# EAGLE schematic TommyPROM-uno (EAGLE 8.0.0)
Tom's EPROM programmer hosted on Arduino Uno.
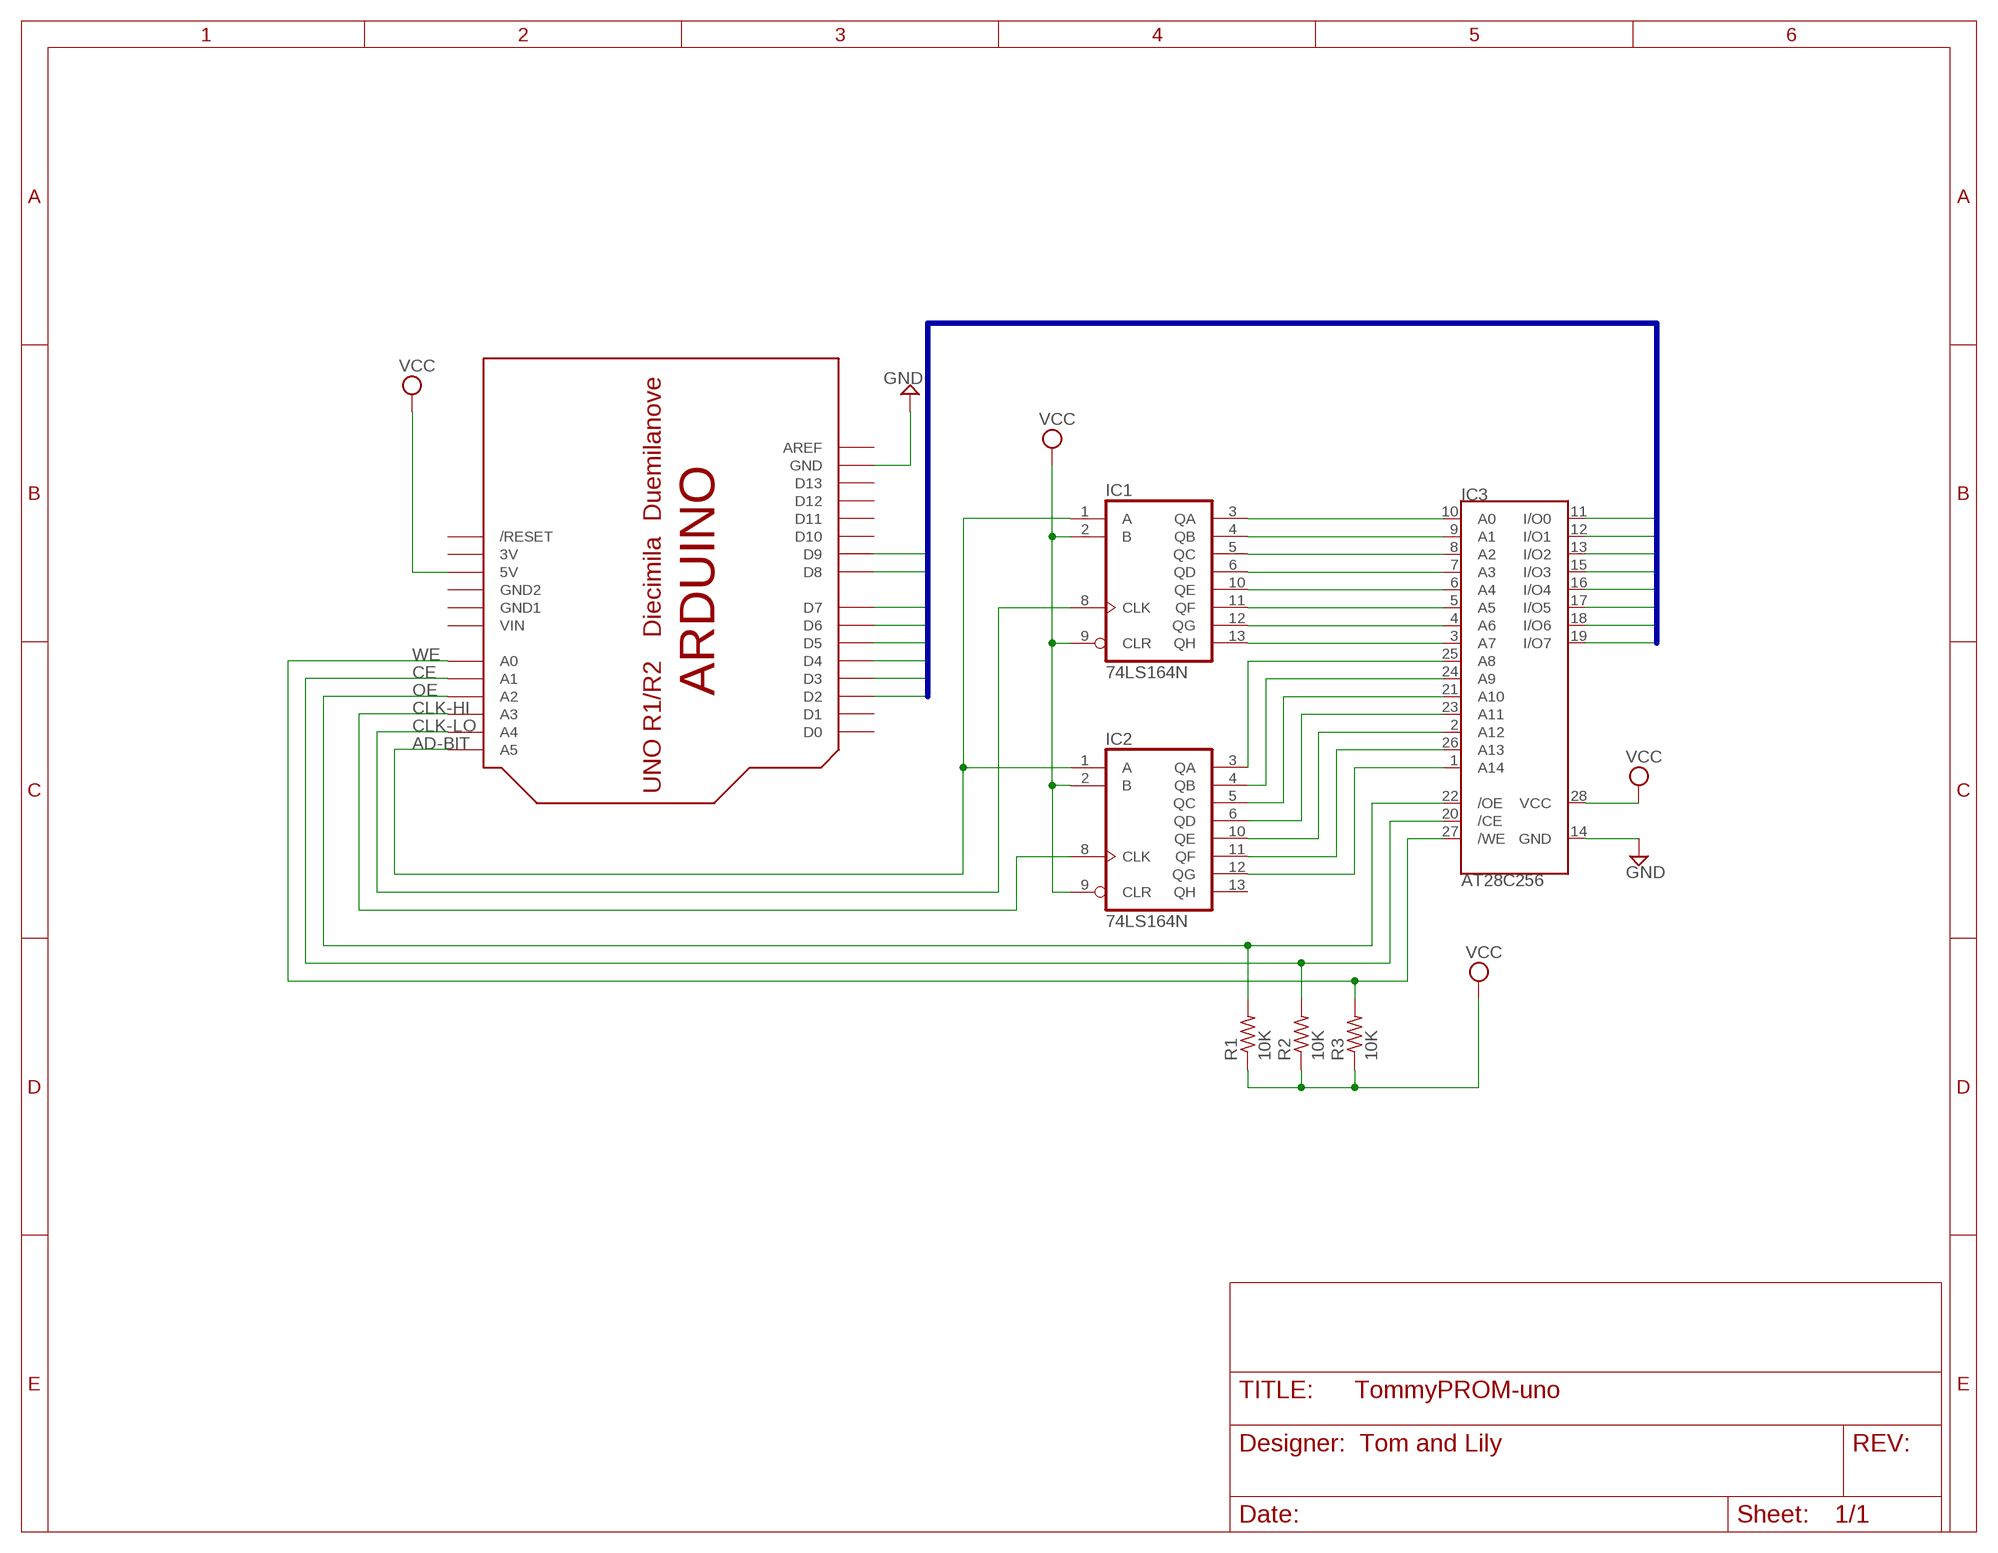
[diagram p0: schematic, sheet 1]

## Parts
IC1  74LS164N  [DIL14]
IC2  74LS164N  [DIL14]
IC3  AT28C256  AT28C256-28DIP  [DIL28-6]
R1  10K  R-US_0204/5  [0204/5]
R2  10K  R-US_0204/5  [0204/5]
R3  10K  R-US_0204/5  [0204/5]
U$1  ARDUINO-BPLACE  [ARDUINO-BPLACE]

## Nets
AD-BIT: IC1.1(A) IC2.1(A) U$1.A5
CE: IC3.20(/CE) R2.2 U$1.A1
CLK-HI: IC2.8(CLK) U$1.A3
CLK-LO: IC1.8(CLK) U$1.A4
D0: IC3.11(I/O0) U$1.D2
D1: IC3.12(I/O1) U$1.D3
D2: IC3.13(I/O2) U$1.D4
D3: IC3.15(I/O3) U$1.D5
D4: IC3.16(I/O4) U$1.D6
D5: IC3.17(I/O5) U$1.D7
D6: IC3.18(I/O6) U$1.D8
D7: IC3.19(I/O7) U$1.D9
GND: IC3.14(GND) U$1.GND
N$6: IC2.12(QG) IC3.1(A14)
N$7: IC2.11(QF) IC3.26(A13)
N$8: IC2.10(QE) IC3.2(A12)
N$9: IC2.6(QD) IC3.23(A11)
N$10: IC2.5(QC) IC3.21(A10)
N$15: IC2.4(QB) IC3.24(A9)
N$16: IC2.3(QA) IC3.25(A8)
N$17: IC1.13(QH) IC3.3(A7)
N$18: IC1.12(QG) IC3.4(A6)
N$19: IC1.11(QF) IC3.5(A5)
N$20: IC1.10(QE) IC3.6(A4)
N$21: IC1.6(QD) IC3.7(A3)
N$22: IC1.5(QC) IC3.8(A2)
N$23: IC1.4(QB) IC3.9(A1)
N$24: IC1.3(QA) IC3.10(A0)
OE: IC3.22(/OE) R1.2 U$1.A2
VCC: IC1.2(B) IC1.9(CLR) IC2.2(B) IC2.9(CLR) IC3.28(VCC) R1.1 R2.1 R3.1 U$1.5V
WE: IC3.27(/WE) R3.2 U$1.A0
Unconnected: IC2.13(QH) U$1.AREF U$1.D0 U$1.D1 U$1.D10 U$1.D11 U$1.D12 U$1.D13 U$1.RESET(/RESET)

## Buses
D[0..7]

## Power pins joined to a net without a drawn wire
3V: U$1.3V
GND: IC1.7(GND) IC2.7(GND)
GND1: U$1.GND1
GND2: U$1.GND2
VCC: IC1.14(VCC) IC2.14(VCC)
VIN: U$1.VIN

## Library data of the parts
IC1 IC2 = 74xx-us:74*164: 8-bit parallel out SHIFT REGISTER
IC3 = mylib_memory:AT28C256-28DIP: IC EEPROM 256KBIT 28DIP
R1-R3 = resistor:R-US_: RESISTOR, American symbol
U$1 = adafruit:ARDUINO: Arduino Diecimila/Duemilanove Make a shield with ease, this package has all the named pins as well as the two mounting drill holes and an outline of the USB and DC power connector. The outline is on the DIMENSION layer, so if your board house uses it they will cut the outline to match. http://www.ladyada.net/library/pcb/eaglelibrary.html